# Altium schematic sheet Linkwitz_Riley.SchDoc: Linkwitz-Riley / Entstörkondensator
size A4; DocumentNumber: 2; Revision: 2; SheetNumber: 2; SheetTotal: 4
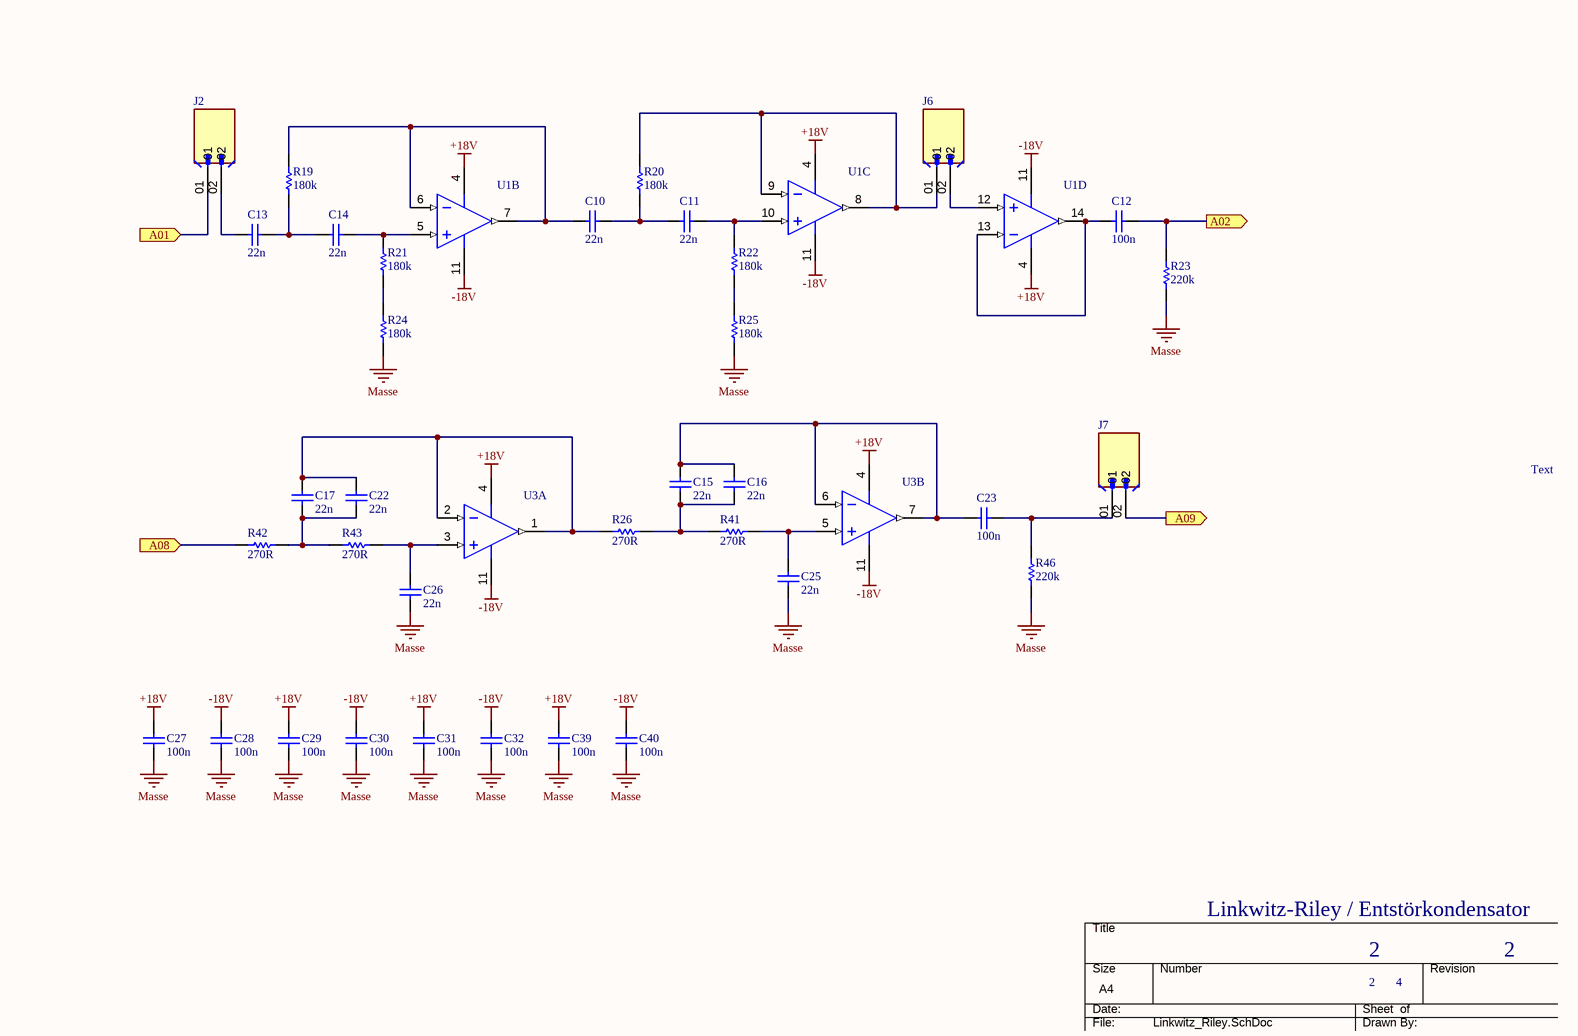
[diagram p0: Linkwitz_Riley.SchDoc]

## Parts
C10  22n  [0805]
C11  22n  [0805]
C12  100n  [0805]
C13  22n  [0805]
C14  22n  [0805]
C15  22n  [0805]
C16  22n  [0805]
C17  22n  [0805]
C22  22n  [0805]
C23  100n  [0805]
C25  22n  [0805]
C26  22n  [0805]
C27  100n  [0805]
C28  100n  [0805]
C29  100n  [0805]
C30  100n  [0805]
C31  100n  [0805]
C32  100n  [0805]
C39  100n  [0805]
C40  100n  [0805]
J2  Connector x2  [Connector x2]  (value not drawn)
J6  Connector x2  [Connector x2]  (value not drawn)
J7  Connector x2  [Connector x2]  (value not drawn)
R19  180k  [0805]
R20  180k  [0805]
R21  180k  [0805]
R22  180k  [0805]
R23  220k  [0805]
R24  180k  [0805]
R25  180k  [0805]
R26  270R  [0805]
R41  270R  [0805]
R42  270R  [0805]
R43  270R  [0805]
R46  220k  [0805]
U1  OPA4134UA  [DIP14 IC Socket]  (value not drawn)  (parts B,C,D of 4)
U3  OPA4134UA  [DIP14 IC Socket]  (value not drawn)  (parts A,B of 4)

## Ports
A01 (in), A02 (out), A08 (in), A09 (out)

## Nets
+18V: C27.2 C29.2 C31.2 C39.2 U1.4(V+) U3.4(V+)
-18V: C28.2 C30.2 C32.2 C40.2 U1.11(V-) U3.11(V-)
Masse: C25.1 C26.1 C27.1 C28.1 C29.1 C30.1 C31.1 C32.1 C39.1 C40.1 R23.1 R24.1 R25.1 R46.1
A01: J2.01 ; port A01
A02: C12.2 R23.2 ; port A02
A08: R42.2 ; port A08
A09: J7.02 ; port A09
NetC10_1: C10.1 R19.2 U1.6(IN_B-) U1.7(OUT_B)
NetC10_2: C10.2 C11.1 R20.1
NetC11_2: C11.2 R22.2 U1.10(IN_C+)
NetC12_1: C12.1 U1.13(IN_D-) U1.14(OUT_D)
NetC13_1: C13.1 J2.02
NetC13_2: C13.2 C14.1 R19.1
NetC14_2: C14.2 R21.2 U1.5(IN_B+)
NetC15_1: C15.1 C16.1 R26.1 R41.2
NetC15_2: C15.2 C16.2 C23.1 U3.6(IN_B-) U3.7(OUT_B)
NetC17_1: C17.1 C22.1 R42.1 R43.2
NetC17_2: C17.2 C22.2 R26.2 U3.1(OUT_A) U3.2(IN_A-)
NetC23_2: C23.2 J7.01 R46.2
NetC25_2: C25.2 R41.1 U3.5(IN_B+)
NetC26_2: C26.2 R43.1 U3.3(IN_A+)
NetJ6_01: J6.01 R20.2 U1.8(OUT_C) U1.9(IN_C-)
NetJ6_02: J6.02 U1.12(IN_D+)
NetR21_1: R21.1 R24.2
NetR22_1: R22.1 R25.2

## Notes on the sheet
- Text
- THIS DOCUMENT AND THE DATA DISCLOSED HEREIN OR
- HEREWITH IS THE PROPERTY OF ALTIUM LIMITED AND MAY
- DWG NO:
- REVISION
- REV:
- DESCRIPTION
- DATE
- APPROVED
- BE FREELY DISTRIBUTED IN WHOLE. NO RIGHTS ARE
- RESERVED OR EXPRESS OR IMPLIED WARANTEE GIVEN.
- ENG:
- APPROVALS
- PROJECT
- DSN:
- CHK:
- REFERENCE DOCUMENTS
- PROJECT REVISION:
- TITLE
- DOCUMENT REVISION:
- DESIGN ITEM:
- BOM:
- FAB DWG:
- PCB DWG:
- ASSY DWG:
- SCALE:
- A3
- SIZE
- CAGE CODE
- FILE NAME
- DWG NO.
- SHEET
- OF
- REV

## Library data of the parts
C10-C17 C22 C23 C25-C32 C39 C40 = 0805 Kondensator
  C10 C11 C13-C17 C22 C25 C26: Value: 22n
  C12 C23 C27-C32 C39 C40: Value: 100n
J2 J6 J7 = Connector x2: Connector Header Through Hole 2 position 0.100 (2.54mm); MF: Wurth Elektronik; MP: 61300211121; SnapEDA_Link: https://www.snapeda.com/parts/61300211121/Wurth+Elektronik/view-part/?ref=snap; Package: None; Value: *; Check_prices: https://www.snapeda.com/parts/61300211121/Wurth+Elektronik/view-part/?ref=eda
R19-R26 R41-R43 R46 = 0805 Widerstand
  R19-R22 R24 R25: Value: 180k
  R23 R46: Value: 220k
  R26 R41-R43: Value: 270R
U1 U3 = SOIC OPA4134UA: SoundPlus(TM) High Performance Audio Operational Amplifier, 5 to 36 V, -55 to 125 degC, 14-pin SOIC (D14), Green (RoHS & no Sb/Br); Manufacturer: Texas Instruments; Vmax(V): 36; Number of Channels: 4; Iq per channel(Max)(mA): 5; GBW(Typ)(MHz): 8; DatasheetVersion: SBOS058; ComponentLink2URL: http://www.ti.com/general/docs/lit/getliterature.tsp?genericPartNumber=OPA4134&fileType=pdf; ComponentLink1URL: http://www.ti.com/; PackageDescription: 14-Pin Plastic Small Outline, Body 8.65 x 3.9 mm, Pitch 1.27 mm; SubFamily: Audio Operational Amplifier; Vmin(V): 5; ComponentLink2Description: Datasheet; PackageVersion: 4040047-5/M, 06/2011; Code_JEDEC: MS-012; PackageReference: D0014A; ComponentLink1Description: Manufacturer URL; Vn at Flatband(Typ)(nV/rtHz): 8; Eco-Plan: Green (RoHS & no Sb/Br); Mounting Technology: Surface Mount; ComponentLink3URL: http://www.ti.com/lit/ml/mpds177g/mpds177g.pdf; PartNumber: OPA4134UA; ComponentLink3Description: Package Specification